# EAGLE design HSDL-9100 (EAGLE 6.4)
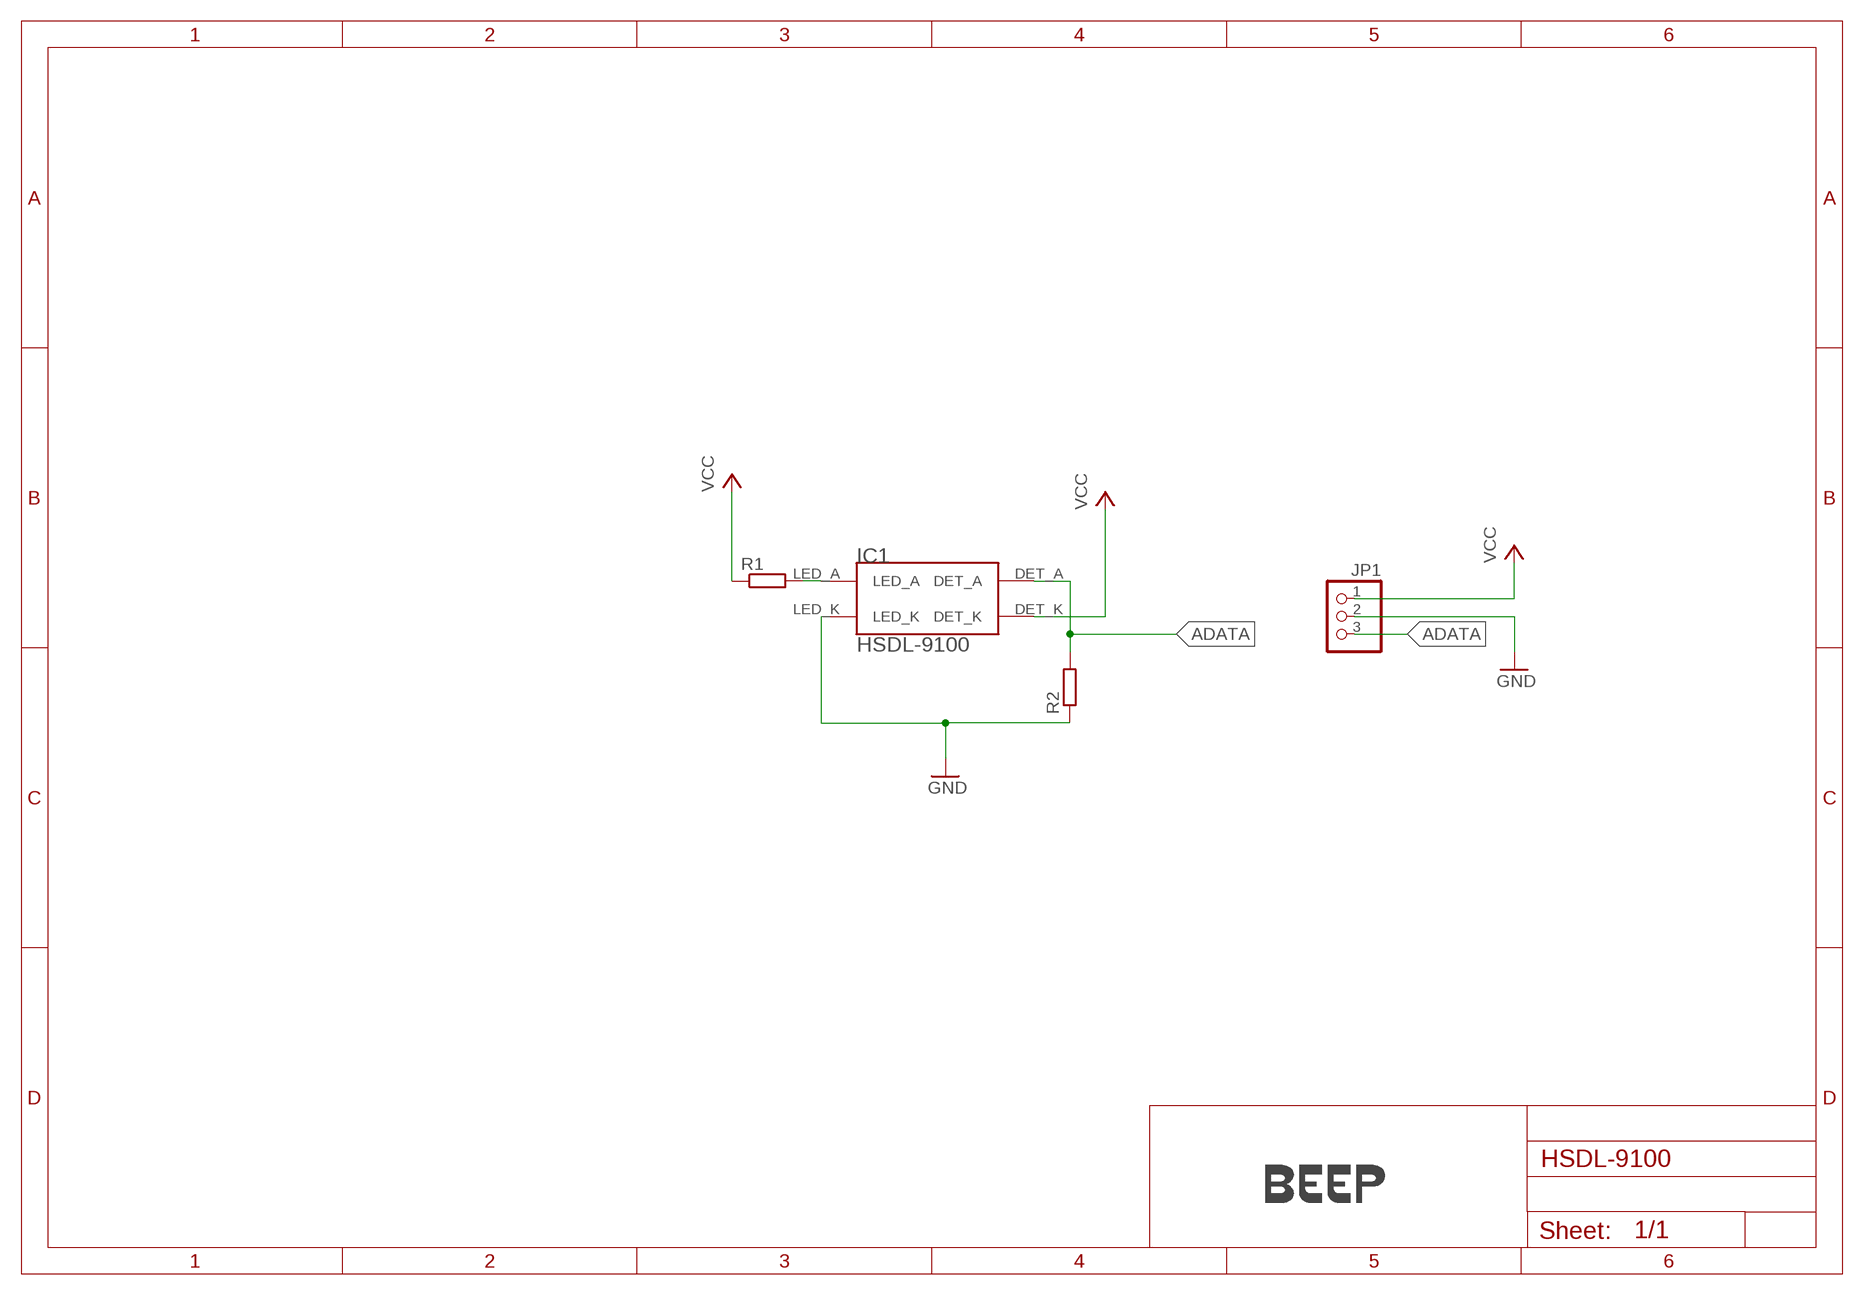
[diagram p0: schematic, sheet 1]

## Parts
IC1  HSDL-9100  [HSDL-9100]
JP1  PINHD-1X3  [1X03]
R1  R-EU_M0805  [M0805]
R2  R-EU_M0805  [M0805]
U$1  LOGO-COPPER3  [COPPER3]

## Nets
ADATA: IC1.DET_A JP1.3 R2.2
GND: IC1.LED_K JP1.2 R2.1
N$3: IC1.LED_A R1.2
VCC: IC1.DET_K JP1.1 R1.1

## Library data of the parts
IC1 = BEEP:HSDL-9100
JP1 = pinhead:PINHD-1X3: PIN HEADER
R1 R2 = rcl:R-EU_: RESISTOR, European symbol
U$1 = Branding:LOGO-COPPER

## Board
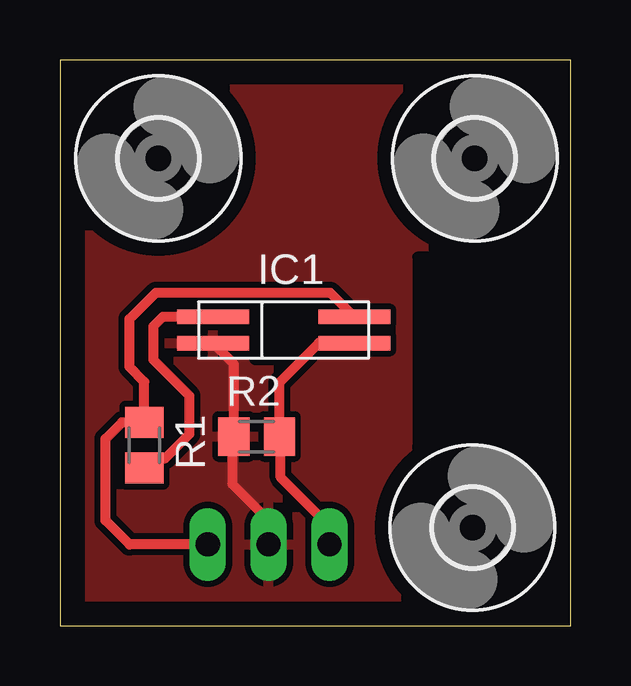
[diagram p1: board, top side]
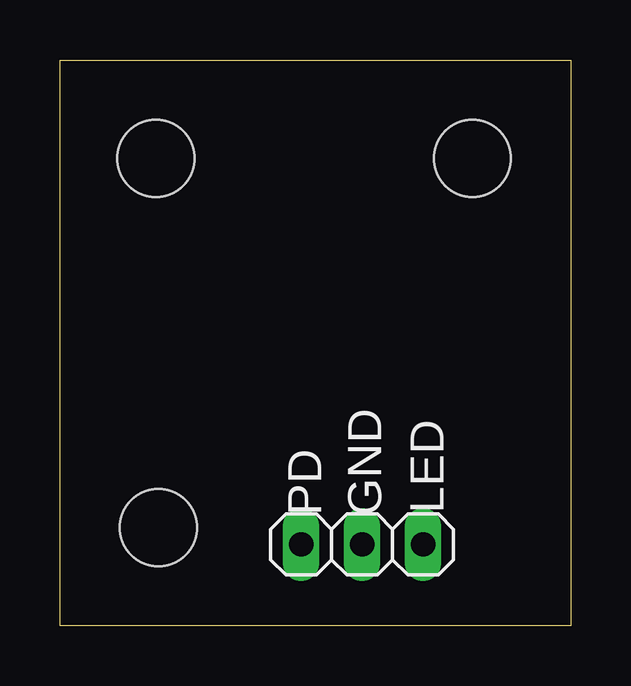
[diagram p2: board, bottom side, seen from below]

Size 21.3 x 23.6 mm. Coordinates in mm from the lower left corner, seen from the top.
Outline: 0,0 21.3,0 21.3,23.6 0,23.6 0,0
Copper layers (1*16): Top 0.035mm / dielectric 1.5mm / Bottom 0.035mm
Design rules "default *": minimum track width 10mil, minimum drill 24mil, track to track 10mil, track to pad 10mil, pad to pad 8mil, via to via 8mil, smd to smd 8mil, copper to edge 40mil, drill to drill 8mil, minimum pad ring 10mil, minimum via ring 8mil, stop-mask expansion 4mil, vias tented up to drill 0mil, thermal gap 10mil
tRestrict: area 14.9,7.5 to 21.3,15.4; 3 lines

### Footprints (pad centres in the part's own frame; a part is rotated, then mirrored left to right if it is on the bottom)
HSDL-9100 = smd 3 x 0.6: DET_A 2.95,-0.55; DET_K 2.95,0.55; LED_A -2.95,0.55; LED_K -2.95,-0.55
1X03 = drill 1.016 long: 1 -2.54,0; 2 0,0; 3 2.54,0
M0805 = smd 1.3 x 1.6: 1 -0.95,0; 2 0.95,0
3,2 = hole 3.2: 0,0

### Placement (x,y rotation side)
IC1  9.33,12.34 0 top
JP1  8.7,3.4 180 bottom
R1  3.52,7.54 270 top
R2  8.2,7.9 0 top
U$1  15.1,12.6 0 top
U$2  [3,2]  17.2,4.1 0 top
U$3  [3,2]  4.1,19.5 0 top
U$4  [3,2]  17.3,19.5 0 top

### Tracks (layer width: path | path; a pad name or v marks a point on that pad's centre or on a via)
ADATA
  Top 0.406: 8.7,7.45 R2.2 | R2.2 9.15,10.15 10.8,11.8 IC1.DET_A | JP1.3 11.24,4.16 9.2,6.2 9.2,7.85 R2.2
GND
  Top 0.406: IC1.LED_K 7.25,10.92 R2.1 7.2,7.85 7.2,5.9 8.7,4.4 JP1.2
  pour Top: 21.3,23.6 0,23.7 0,0 21.3,-0.1
N$3
  Top 0.406: R1.2 4.29,6.99 4.39,6.99 5.4,8 5.4,9.6 3.9,11.1 3.9,12.5 4.3,12.9 IC1.LED_A
VCC
  Top 0.406: IC1.DET_K 11.27,13.9 4,13.9 2.9,12.8 2.9,10.8 3.52,10.18 R1.1 2.59,8.49 1.9,7.8 1.9,4.4 2.9,3.4 JP1.1

### Text on the board
bNames: LED | GND | PD
tCName: HSDL-9100 / v0.2